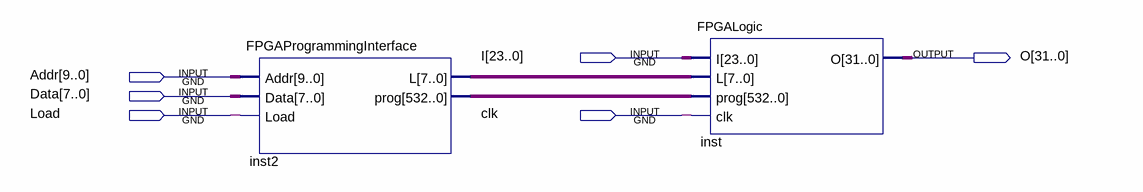
[diagram p0: schematic sheet]
// Quartus schematic FPGA.bdf as structural Verilog: 2 symbols, 6 pins
module FPGA (
  input  [23:0] I,
  input  [9:0] Addr,
  input  [7:0] Data,
  input  Load,
  input  clk,
  output [31:0] O
);

  wire [7:0] inst2_l;
  wire [532:0] inst2_prog;

  FPGAProgrammingInterface inst2 (.Addr(Addr), .Data(Data), .Load(Load), .L(inst2_l), .prog(inst2_prog));
  FPGALogic inst (.I(I), .L(inst2_l), .prog(inst2_prog), .clk(clk), .O(O));
endmodule
